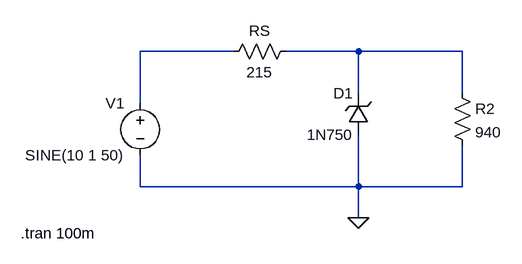
[diagram p0: schematic 06. regolatore di tensione con diodo zener.asc]
06. regolatore di tensione con diodo zener.asc, the LTspice schematic file:
Version 4
SHEET 1 880 680
WIRE 192 80 48 80
WIRE 384 80 272 80
WIRE 544 80 384 80
WIRE 384 144 384 80
WIRE 544 144 544 80
WIRE 48 160 48 80
WIRE 48 288 48 240
WIRE 384 288 384 208
WIRE 384 288 48 288
WIRE 544 288 544 224
WIRE 544 288 384 288
WIRE 384 336 384 288
FLAG 384 336 0
SYMBOL voltage 48 144 M0
WINDOW 123 0 0 Left 0
WINDOW 39 0 0 Left 0
SYMATTR InstName V1
SYMATTR Value SINE(10 1 50)
SYMBOL res 288 64 R90
WINDOW 0 0 56 VBottom 2
WINDOW 3 32 56 VTop 2
SYMATTR InstName RS
SYMATTR Value 215
SYMBOL zener 400 208 R180
WINDOW 0 24 64 Left 2
WINDOW 3 24 0 Left 2
SYMATTR InstName D1
SYMATTR Value 1N750
SYMATTR Description Diode
SYMATTR Type diode
SYMBOL res 528 128 R0
SYMATTR InstName R2
SYMATTR Value 940
TEXT -136 360 Left 2 !.tran 100m

The netlist it stands for:
* 06. regolatore di tensione con diodo zener.asc
V1 N001 0 SINE(10 1 50)
RS N002 N001 215
D1 0 N002 1N750
R2 N002 0 940
.model D D
.lib standard.dio
.tran 100m
.backanno
.end